# Altium schematic sheet Ethernet.SchDoc
size Letter; Organization: Altium Limited; Address1: L3, 12a Rodborough Rd; Address2: Frenchs Forest; Address3: NSW; Address4: Australia 2086
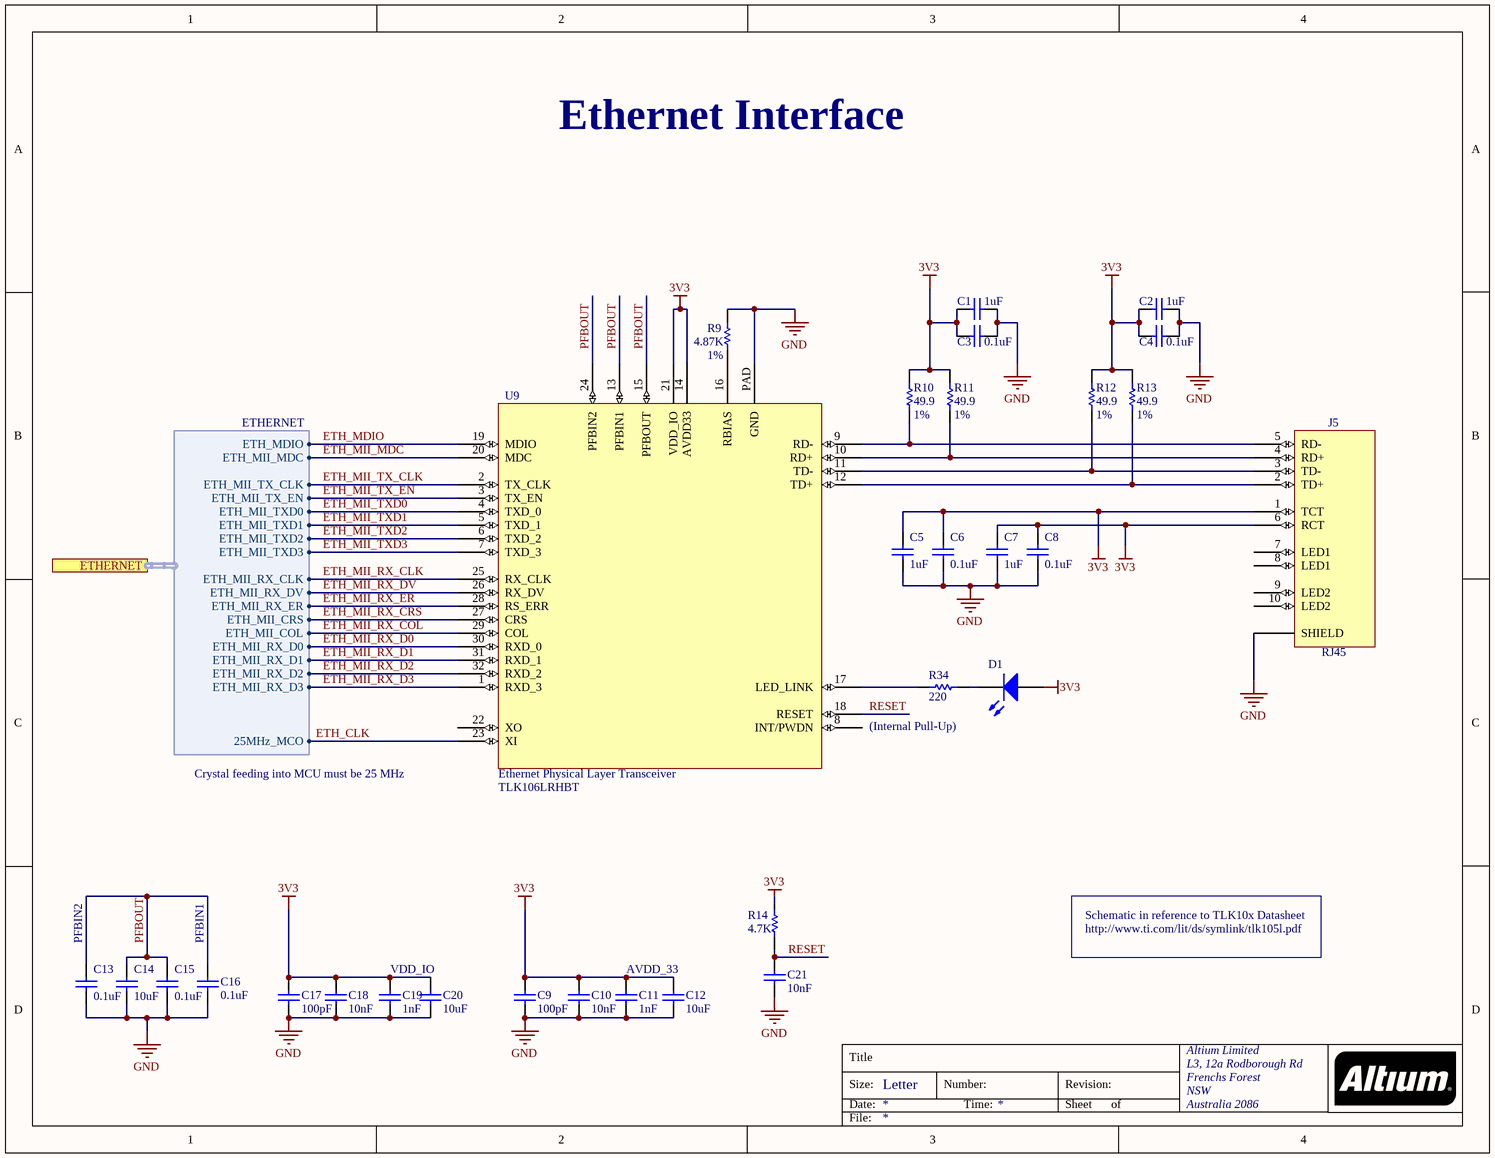
[diagram p0: Ethernet.SchDoc]

## Parts
C1  value 1uF  [0402]  (hidden comment: Cap)
C2  value 1uF  [0402]  (hidden comment: Cap)
C3  value 0.1uF  [0402]  (hidden comment: Cap)
C4  value 0.1uF  [0402]  (hidden comment: Cap)
C5  value 1uF  [0402]  (hidden comment: Cap)
C6  value 0.1uF  [0402]  (hidden comment: Cap)
C7  value 1uF  [0402]  (hidden comment: Cap)
C8  value 0.1uF  [0402]  (hidden comment: Cap)
C9  value 100pF  [0402]  (hidden comment: Cap Semi)
C10  value 10nF  [0402]  (hidden comment: Cap Semi)
C11  value 1nF  [0402]  (hidden comment: Cap Semi)
C12  value 10uF  [0402]  (hidden comment: Cap Semi)
C13  value 0.1uF  [0402]  (hidden comment: Cap Semi)
C14  value 10uF  [0402]  (hidden comment: Cap Semi)
C15  value 0.1uF  [0402]  (hidden comment: Cap Semi)
C16  value 0.1uF  [0402]  (hidden comment: Cap Semi)
C17  value 100pF  [0402]  (hidden comment: Cap Semi)
C18  value 10nF  [0402]  (hidden comment: Cap Semi)
C19  value 1nF  [0402]  (hidden comment: Cap Semi)
C20  value 10uF  [0402]  (hidden comment: Cap Semi)
C21  value 10nF  [0402]  (hidden comment: Cap Semi)
D1  LED3  [0402]  (value not drawn)
J5  RJ45  [RJ45]
R9  value 4.87K  Tolerance: 1%  [0402]  (hidden comment: Res1)
R10  value 49.9  Tolerance: 1%  [0402]  (hidden comment: Res1)
R11  value 49.9  Tolerance: 1%  [0402]  (hidden comment: Res1)
R12  value 49.9  Tolerance: 1%  [0402]  (hidden comment: Res1)
R13  value 49.9  Tolerance: 1%  [0402]  (hidden comment: Res1)
R14  value 4.7K  [0402]  (hidden comment: Res1)
R34  value 220  [0402]  (hidden comment: Res1)
U9  Ethernet Physical Layer Transceiver  [VQFN32-PHY-TRANSCEIVER]

## Ports
ETHERNET (harness ETHERNET)

## Harnesses
ETHERNET: ETH_MDIO, ETH_MII_COL, ETH_MII_CRS, ETH_MII_MDC, ETH_MII_RX_CLK, ETH_MII_RX_D0, ETH_MII_RX_D1, ETH_MII_RX_D2, ETH_MII_RX_D3, ETH_MII_RX_DV, ETH_MII_RX_ER, ETH_MII_TX_CLK, ETH_MII_TX_EN, ETH_MII_TXD0, ETH_MII_TXD1, ETH_MII_TXD2, ETH_MII_TXD3, 25MHz_MCO

## Nets
3V3: C1.2 C2.2 C3.2 C4.2 C5.1 C6.1 C7.1 C8.1 C9.2 C10.2 C11.2 C12.2 C17.2 C18.2 C19.2 C20.2 D1.1(A) J5.1(TCT) J5.6(RCT) R10.2 R11.2 R12.2 R13.2 R14.2 U9.14(AVDD33) U9.21(VDD_IO)
GND: C1.1 C2.1 C3.1 C4.1 C5.2 C6.2 C7.2 C8.2 C9.1 C10.1 C11.1 C12.1 C13.1 C14.1 C15.1 C16.1 C17.1 C18.1 C19.1 C20.1 C21.1 J5.SHIELD R9.2 U9.PAD(GND)
ETH_CLK: U9.23(XI) ; port ETHERNET.25MHz_MCO
ETH_MDIO: U9.19(MDIO) ; port ETHERNET.ETH_MDIO
ETH_MII_MDC: U9.20(MDC) ; port ETHERNET.ETH_MII_MDC
ETH_MII_RX_CLK: U9.25(RX_CLK) ; port ETHERNET.ETH_MII_RX_CLK
ETH_MII_RX_COL: U9.29(COL) ; port ETHERNET.ETH_MII_COL
ETH_MII_RX_CRS: U9.27(CRS) ; port ETHERNET.ETH_MII_CRS
ETH_MII_RX_D0: U9.30(RXD_0) ; port ETHERNET.ETH_MII_RX_D0
ETH_MII_RX_D1: U9.31(RXD_1) ; port ETHERNET.ETH_MII_RX_D1
ETH_MII_RX_D2: U9.32(RXD_2) ; port ETHERNET.ETH_MII_RX_D2
ETH_MII_RX_D3: U9.1(RXD_3) ; port ETHERNET.ETH_MII_RX_D3
ETH_MII_RX_DV: U9.26(RX_DV) ; port ETHERNET.ETH_MII_RX_DV
ETH_MII_RX_ER: U9.28(RS_ERR) ; port ETHERNET.ETH_MII_RX_ER
ETH_MII_TX_CLK: U9.2(TX_CLK) ; port ETHERNET.ETH_MII_TX_CLK
ETH_MII_TX_EN: U9.3(TX_EN) ; port ETHERNET.ETH_MII_TX_EN
ETH_MII_TXD0: U9.4(TXD_0) ; port ETHERNET.ETH_MII_TXD0
ETH_MII_TXD1: U9.5(TXD_1) ; port ETHERNET.ETH_MII_TXD1
ETH_MII_TXD2: U9.6(TXD_2) ; port ETHERNET.ETH_MII_TXD2
ETH_MII_TXD3: U9.7(TXD_3) ; port ETHERNET.ETH_MII_TXD3
PFBOUT: C13.2 C14.2 C15.2 C16.2 U9.13(PFBIN1) U9.15(PFBOUT) U9.24(PFBIN2)
RESET: C21.2 R14.1 U9.18(RESET)
NetD1_2: D1.2(K) R34.2
NetJ5_2: J5.2(TD+) R13.1 U9.12(TD+)
NetJ5_3: J5.3(TD-) R12.1 U9.11(TD-)
NetJ5_4: J5.4(RD+) R11.1 U9.10(RD+)
NetJ5_5: J5.5(RD-) R10.1 U9.9(RD-)
NetR9_1: R9.1 U9.16(RBIAS)
NetR34_1: R34.1 U9.17(LED_LINK)

Not connected (* = marked no-connect by the designer): J5 7(LED1) 8(LED1) 9(LED2) 10(LED2); U9 8(INT/PWDN) 22(XO)

## Notes on the sheet
- Ethernet Interface
- Crystal feeding into MCU must be 25 MHz
- (Internal Pull-Up)
- PFBIN2
- PFBIN1
- VDD_IO
- AVDD_33
- http://www.ti.com/lit/ds/symlink/tlk105l.pdf
- Schematic in reference to TLK10x Datasheet
- Title
- Size:
- Date:
- Letter
- Number:
- Time:
- Revision:
- Sheet
- of
- File:

## Library data of the parts
C1-C8 = Cap: Capacitor
C9-C21 = Cap Semi: Capacitor (Semiconductor SIM Model)
D1 = LED3: Typical BLUE SiC LED; Mnf Part No: APHHS1005SYCK; DigiKey Part No: 754-1105-1-ND
J5 = RJ45 Jack with Magnetics: Ethernet Jack with Magnetics; Manufacturer Part Number: 08B0-1X1T-03-F; Manufacturer: Bel Fuse Inc.; DigiKey Part Number: 507-1444-ND; Applications: 10/100 Base-T
R9-R14 R34 = Res1: Resistor
U9 = TLK106LRHBT: Supply Voltage: 3 V ~ 3.6 V; Operating Temperature: -40°C ~ 105°C; Base Part Number: TLK106; DigiKey Part Number: 296-39585-2-ND; Manufacturer Part Number: TLK106LRHBT